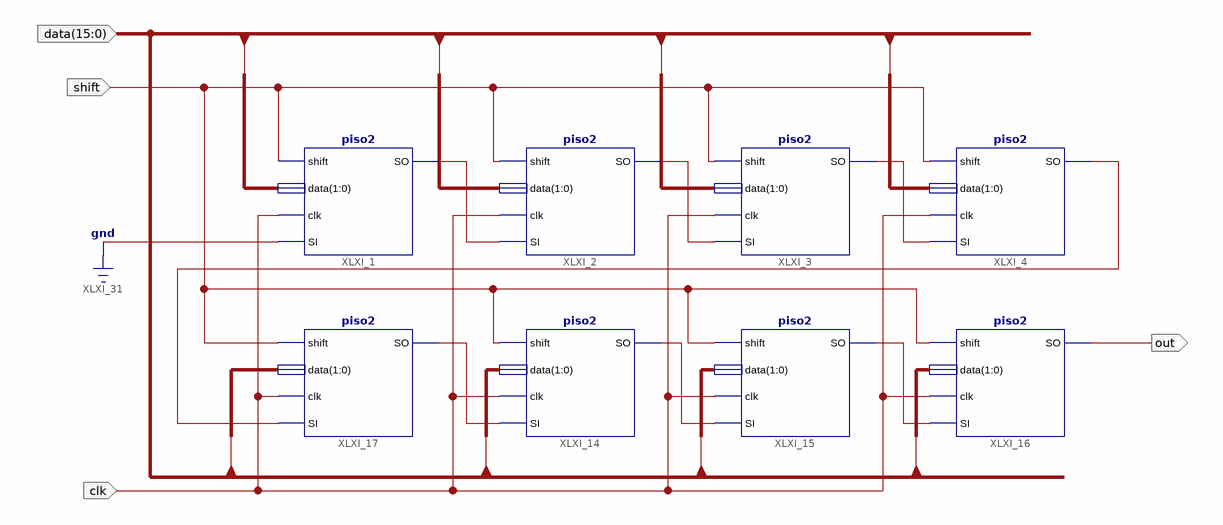
[diagram p0: schematic sheet 1]
// Xilinx ISE schematic piso16.sch (spartan6) as structural Verilog: 8 symbols, 4 ports
module piso16 (
  input  [15:0] data,
  input  clk,
  input  shift,
  output out
);

  wire XLXN_10, XLXN_11, XLXN_12, XLXN_18, XLXN_19, XLXN_20, XLXN_36;

  piso2 XLXI_1 (.shift(shift), .data(data[1:0]), .clk(clk), .SI(1'b0), .SO(XLXN_10));
  piso2 XLXI_17 (.shift(shift), .data(data[9:8]), .clk(clk), .SI(XLXN_36), .SO(XLXN_18));
  piso2 XLXI_2 (.shift(shift), .data(data[3:2]), .clk(clk), .SI(XLXN_10), .SO(XLXN_11));
  piso2 XLXI_14 (.shift(shift), .data(data[11:10]), .clk(clk), .SI(XLXN_18), .SO(XLXN_19));
  piso2 XLXI_3 (.shift(shift), .data(data[5:4]), .clk(clk), .SI(XLXN_11), .SO(XLXN_12));
  piso2 XLXI_15 (.shift(shift), .data(data[13:12]), .clk(clk), .SI(XLXN_19), .SO(XLXN_20));
  piso2 XLXI_4 (.shift(shift), .data(data[7:6]), .clk(clk), .SI(XLXN_12), .SO(XLXN_36));
  piso2 XLXI_16 (.shift(shift), .data(data[15:14]), .clk(clk), .SI(XLXN_20), .SO(out));
endmodule
